# Altium schematic sheet CAN.SchDoc
size A4
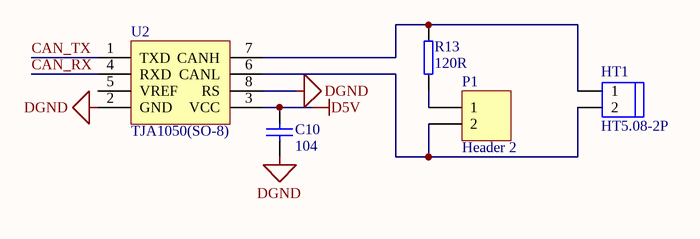
[diagram p0: CAN.SchDoc]

## Parts
C10  104  [0805C]
HT1  HT5.08-2P  [HEAD2-5.08]
P1  Header 2  [HDR1X2]
R13  120R  [2512R]
U2  TJA1050(SO-8)

## Nets
D5V: C10.2 U2.3(VCC)
DGND: C10.1 U2.2(GND) U2.8(RS)
CAN_RX: U2.4(RXD)
CAN_TX: U2.1(TXD)
NetHT1_1: HT1.1 R13.2 U2.7(CANH)
NetHT1_2: HT1.2 P1.2 U2.6(CANL)
NetP1_1: P1.1 R13.1

Not connected (* = marked no-connect by the designer): U2 5(VREF)

## Library data of the parts
C10 = Cap: 贴片电容
HT1 = HT5.08-2P: 5.08蓝色接口座子
P1 = Header 2: Header, 2-Pin; LatestRevisionDate: 17-Jul-2002; LatestRevisionNote: Re-released for DXP Platform.; Publisher: Altium Limited
R13 = RES-10K
U2 = TJA1050(SO-8): CAN芯片